# EAGLE schematic mainboard (EAGLE 9.6.1)
Assembly variants: Main
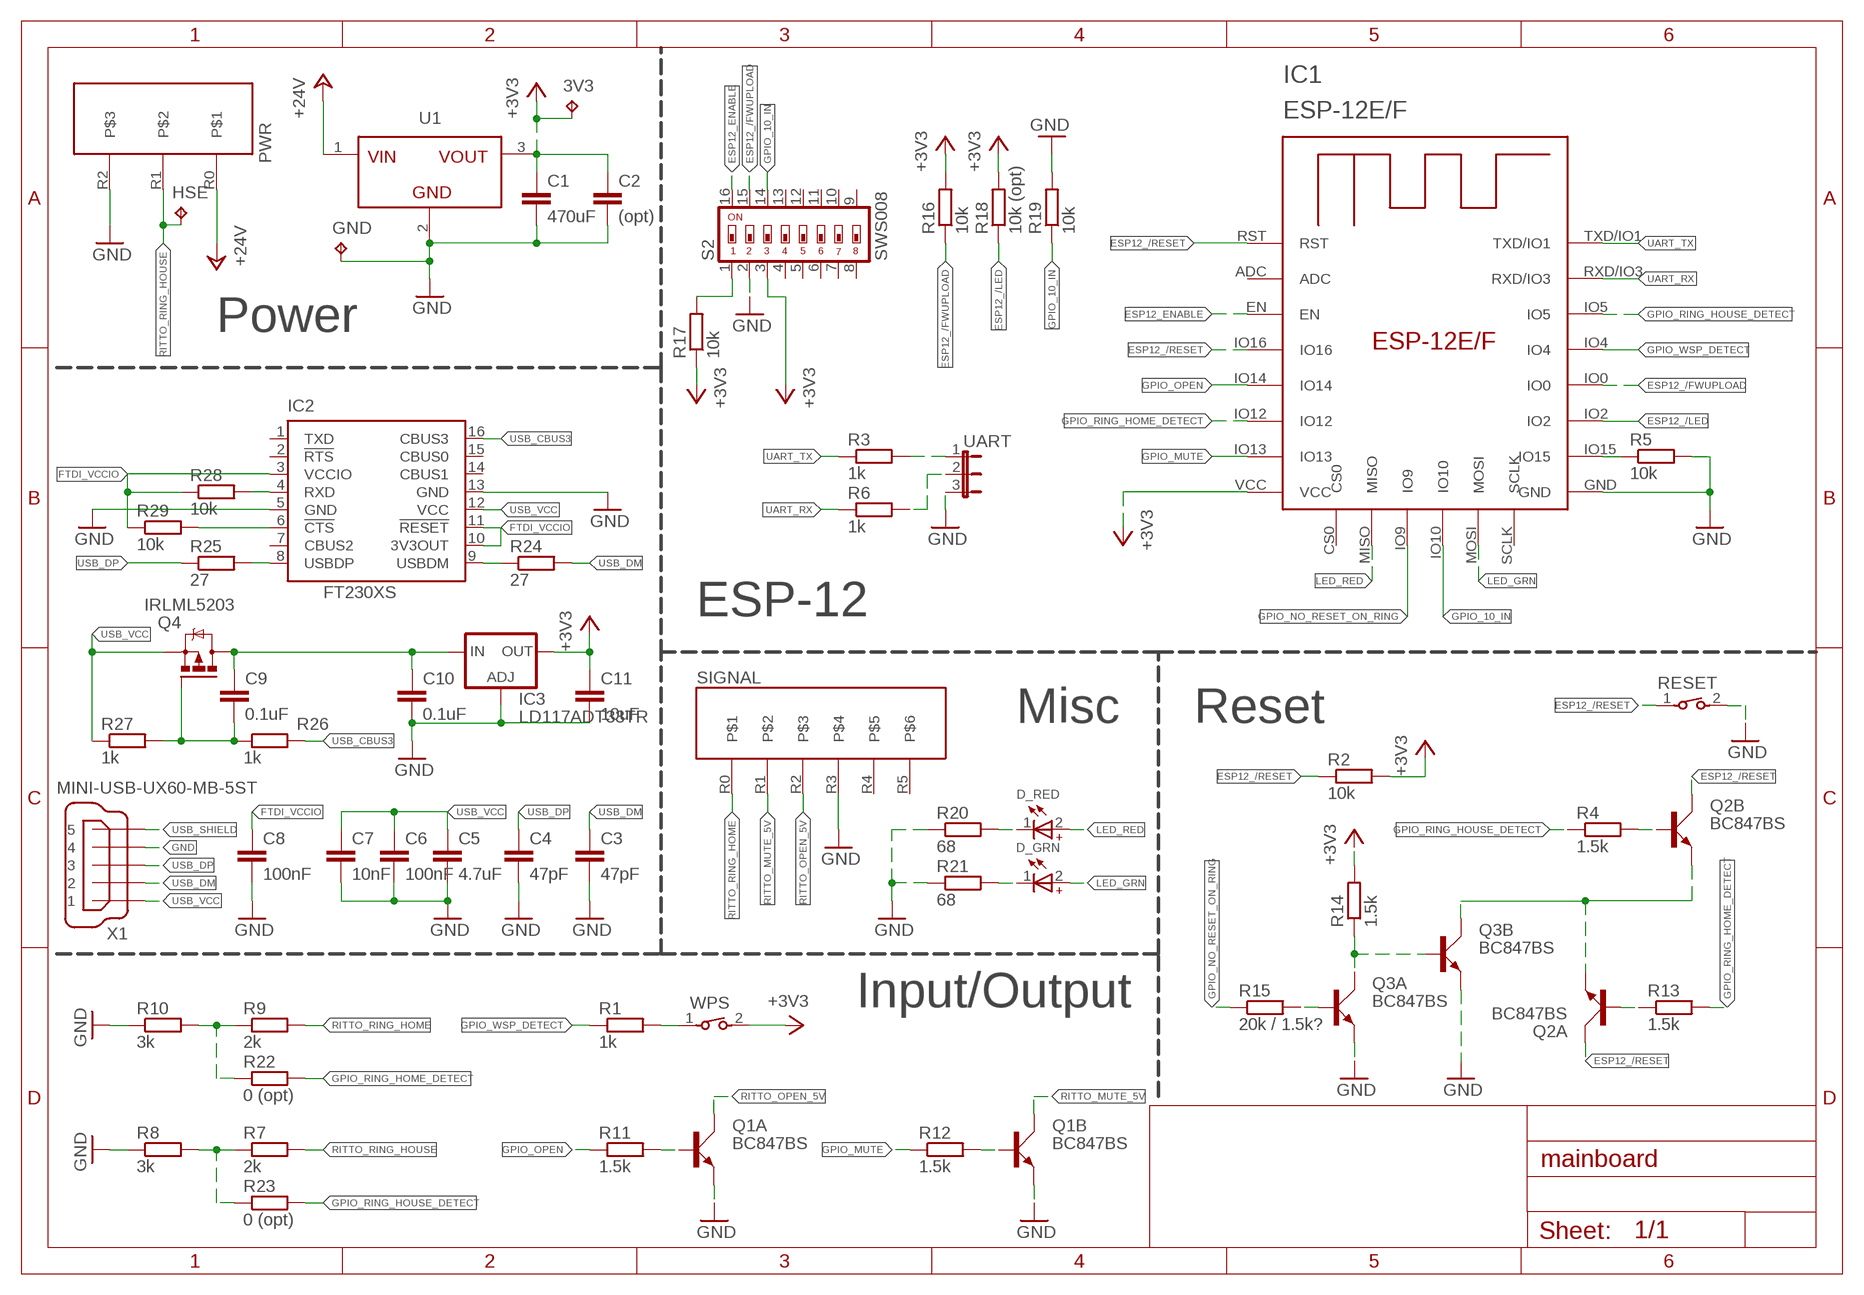
[diagram p0: schematic, sheet 1]

## Parts
3V3  TPTP10SQ  [TP10SQ]
C1  470uF  C-EUC1206  [C1206]
C2  (opt)  C-EUC1206  [C1206]
C3  47pF  C-EUC1206  [C1206]
C4  47pF  C-EUC1206  [C1206]
C5  4.7uF  C-EUC1206  [C1206]
C6  100nF  C-EUC1206  [C1206]
C7  10nF  C-EUC1206  [C1206]
C8  100nF  C-EUC1206  [C1206]
C9  0.1uF  C-EUC1206  [C1206]
C10  0.1uF  C-EUC1206  [C1206]
C11  10uF  C-EUC1206  [C1206]
D_GRN  WL-SMRW_1206_CYL_156120VS75300_NOR  [WL-SMRW_1206_CYL]
D_RED  WL-SMRW_1206_CYL_156120RS75300_NOR  [WL-SMRW_1206_CYL]
GND  TPTP10SQ  [TP10SQ]
HSE  TPTP10SQ  [TP10SQ]
IC1  ESP-12E/F  [ESP-12E]
IC2  FT230XS  [SSOP16]
IC3  LD117ADT33TR  [DPACK]
PWR  RAST_3  [RAST_3]
Q1  BC847BS  [SOT363_PHILIPS]
Q2  BC847BS  [SOT363_PHILIPS]
Q3  BC847BS  [SOT363_PHILIPS]
Q4  IRLML5203  [MICRO3]
R1  1k  R-EU_R1206  [R1206]
R2  10k  R-EU_R1206  [R1206]
R3  1k  R-EU_R1206  [R1206]
R4  1.5k  R-EU_R1206  [R1206]
R5  10k  R-EU_R1206  [R1206]
R6  1k  R-EU_R1206  [R1206]
R7  2k  R-EU_R1206  [R1206]
R8  3k  R-EU_R1206  [R1206]
R9  2k  R-EU_R1206  [R1206]
R10  3k  R-EU_R1206  [R1206]
R11  1.5k  R-EU_R1206  [R1206]
R12  1.5k  R-EU_R1206  [R1206]
R13  1.5k  R-EU_R1206  [R1206]
R14  1.5k  R-EU_R1206  [R1206]
R15  20k / 1.5k?  R-EU_R1206  [R1206]
R16  10k  R-EU_R1206  [R1206]
R17  10k  R-EU_R1206  [R1206]
R18  10k (opt)  R-EU_R1206  [R1206]
R19  10k  R-EU_R1206  [R1206]
R20  68  R-EU_R1206  [R1206]
R21  68  R-EU_R1206  [R1206]
R22  0 (opt)  R-EU_R1206  [R1206]
R23  0 (opt)  R-EU_R1206  [R1206]
R24  27  R-EU_R1206  [R1206]
R25  27  R-EU_R1206  [R1206]
R26  1k  R-EU_R1206  [R1206]
R27  1k  R-EU_R1206  [R1206]
R28  10k  R-EU_R1206  [R1206]
R29  10k  R-EU_R1206  [R1206]
RESET  434123025816  [434123025816]
S2  SWS008  [SMS-008]
SIGNAL  RAST_6  [RAST_6]
U1  MAGI³C-FDSM_SIP-3_173950378_17395XX78  [MAGI³C-FDSM_17395XX78]
UART  JP2E  [JP2]
WPS  434123025816  [434123025816]
X1  MINI-USB-UX60-MB-5ST  [UX60-MB-5ST]

## Nets
+3V3: 3V3.TP C1.1 C2.1 C11.1 IC1.VCC IC3.4(OUT) R2.2 R14.2 R16.2 R17.1 R18.2 S2.3 U1.3(VOUT) WPS.2
+24V: PWR.R0 U1.1(VIN)
ESP12_/FWUPLOAD: IC1.IO0 R16.1 S2.15
ESP12_/LED: IC1.IO2 R18.1
ESP12_/RESET: IC1.IO16 IC1.RST Q2.3(B:C) Q2.6(A:C) R2.1 RESET.1
ESP12_ENABLE: IC1.EN S2.16
FTDI_VCCIO: C8.1 IC2.3(VCCIO) IC2.10(3V3OUT) IC2.11(!RESET) R28.1 R29.1
GND: C1.2 C2.2 C3.2 C4.2 C5.2 C6.2 C7.2 C8.2 C10.2 C11.2 GND.TP IC1.GND IC2.5(GND) IC2.13(GND) IC3.1(ADJ) PWR.R2 Q1.1(A:E) Q1.4(B:E) Q3.1(A:E) Q3.4(B:E) R5.2 R8.1 R10.1 R19.2 R20.1 R21.1 RESET.2 S2.2 SIGNAL.R3 U1.2(GND) UART.3 X1.4
GPIO_10_IN: IC1.IO10 R19.1 S2.14
GPIO_MUTE: IC1.IO13 R12.1
GPIO_NO_RESET_ON_RING: IC1.IO9 R15.1
GPIO_OPEN: IC1.IO14 R11.1
GPIO_RING_HOME_DETECT: IC1.IO12 R13.2 R22.2
GPIO_RING_HOUSE_DETECT: IC1.IO5 R4.1 R23.2
GPIO_WSP_DETECT: IC1.IO4 R1.1
LED_GRN: D_GRN.2(+) IC1.MOSI
LED_RED: D_RED.2(+) IC1.MISO
N$1: R3.2 UART.1
N$2: R6.2 UART.2
N$3: IC1.IO15 R5.1
N$4: R1.2 WPS.1
N$5: R7.1 R8.2 R23.1
N$6: R9.1 R10.2 R22.1
N$7: R17.2 S2.1
N$8: Q2.5(B:B) R4.2
N$9: Q2.2(A:B) R13.1
N$10: Q1.2(A:B) R11.2
N$11: Q1.5(B:B) R12.2
N$12: D_RED.1(-) R20.2
N$13: D_GRN.1(-) R21.2
N$14: Q3.5(B:B) Q3.6(A:C) R14.1
N$15: Q3.2(A:B) R15.2
N$16: Q2.1(A:E) Q2.4(B:E) Q3.3(B:C)
N$17: IC2.9(USBDM) R24.1
N$18: C9.2 Q4.1(G) R26.1 R27.2
N$19: IC2.8(USBDP) R25.2
N$20: C9.1 C10.1 IC3.3(IN) Q4.3(D)
N$21: IC2.4(RXD) R28.2
N$22: IC2.6(!CTS) R29.2
RITTO_MUTE_5V: Q1.3(B:C) SIGNAL.R1
RITTO_OPEN_5V: Q1.6(A:C) SIGNAL.R2
RITTO_RING_HOME: R9.2 SIGNAL.R0
RITTO_RING_HOUSE: HSE.TP PWR.R1 R7.2
UART_RX: IC1.RXD/IO3 R6.1
UART_TX: IC1.TXD/IO1 R3.1
USB_CBUS3: IC2.16(CBUS3) R26.2
USB_DM: C3.1 R24.2 X1.2
USB_DP: C4.1 R25.1 X1.3
USB_SHIELD: X1.5
USB_VCC: C5.1 C6.1 C7.1 IC2.12(VCC) Q4.2(S) R27.1 X1.1
Unconnected: IC1.ADC IC1.CS0 IC1.SCLK IC2.1(TXD) IC2.2(!RTS) IC2.7(CBUS2) IC2.14(CBUS1) IC2.15(CBUS0) S2.4 S2.5 S2.6 S2.7 S2.8 S2.9 S2.10 S2.11 S2.12 S2.13 SIGNAL.R4 SIGNAL.R5

## Notes on the sheet
- Power
- ESP-12
- Misc | Reset
- Input/Output

## Library data of the parts
3V3 GND HSE = testpad:TP: Test pad
C1-C11 = rcl:C-EU: CAPACITOR, European symbol; SPICEPREFIX: C
D_GRN = 156120RS75300_Eagle_WL-SMRW_rev20b:WL-SMRW_1206_CYL: WL-SMRW SMD Mono-color Reverse mount Waterclear Characteristics Small size & thin body for space saving Ideal for narrow space applications Wide viewing angle Low power consumption Industry standard footprint Small LED package for exceptional brightness To emit light through a small cut-out hole in PCB Compatible with automatic placement machine Applications Front panels indicators LCD backlighting Keypad backlighting Push button backlighting Symbol and switch backlighting General LED lighting <https://www.we-online.com/catalog/media/o35733v209%20Family_WL-SMRW_neu.jpg> Details see: http://katalog.we-online.de/en/led/WL-SMRW?m Updated By Yingchun,Shan,2020-03-19 2020 (C) Wurth Elektronik; ABSTRAHLWINKEL: 140°; CHIP-TECHNOLOGY: AlInGaP; DATASHEET-URL: https://www.we-online.com/catalog/datasheet/156120VS75300.pdf; EMITTING-COLOR: Bright Green; I-V-TYP: 30mcd; LAMDA-DOM-TYP: 573nm; LAMDA-PEAK-TYP: 575nm; PART-NUMBER: 156120VS75300; V-F-TYP: 2V
D_RED = 156120RS75300_Eagle_WL-SMRW_rev20b:WL-SMRW_1206_CYL: WL-SMRW SMD Mono-color Reverse mount Waterclear Characteristics Small size & thin body for space saving Ideal for narrow space applications Wide viewing angle Low power consumption Industry standard footprint Small LED package for exceptional brightness To emit light through a small cut-out hole in PCB Compatible with automatic placement machine Applications Front panels indicators LCD backlighting Keypad backlighting Push button backlighting Symbol and switch backlighting General LED lighting <https://www.we-online.com/catalog/media/o35733v209%20Family_WL-SMRW_neu.jpg> Details see: http://katalog.we-online.de/en/led/WL-SMRW?m Updated By Yingchun,Shan,2020-03-19 2020 (C) Wurth Elektronik; ABSTRAHLWINKEL: 140°; CHIP-TECHNOLOGY: AlInGaP; DATASHEET-URL: https://www.we-online.com/catalog/datasheet/156120RS75300.pdf; EMITTING-COLOR: Red; I-V-TYP: 60mcd; LAMDA-DOM-TYP: 624nm; LAMDA-PEAK-TYP: 632nm; PART-NUMBER: 156120RS75300; V-F-TYP: 2V
IC1 = esp-12e-f:ESP-12E/F
IC2 = ftdichip:FT230X: USB to BASIC UART IC Auto generated by make-symbol-device-package-bsdl.ulp Rev. 43 Source: Data sheet <http://www.ftdichip.com/Support/Documents/DataSheets/ICs/DS_FT230X.pdf>
IC3 = v-reg:LD117A?*: Low drop fixed and adjustable positive voltage regulators 1 A Source: http://www.st.com/stonline/products/literature/ds/7194/ld1117axx.pdf
PWR = own_rast:RAST_3: RAST connector with 3 pins
Q1-Q3 = transistor-small-signal:BC847BS: NPN general purpose double transistor Source: http://www.farnell.com/datasheets/2466.pdf
Q4 = transistor-power:IRLML5203: HEXFET P-Channel Power MOSFET
R1-R29 = rcl:R-EU_: RESISTOR, European symbol; SPICEPREFIX: R
RESET WPS = 434123025816_Eagle_WS-TASV_rev20a:434123025816: WS-TASV J-Bend SMT Tact Switch 6.0x3.8 mm Material Properties Cover Material : Stainless Steel Properties Actuator Material:LCP Actuator Flammability :UL94 V-0 Rating Actuator Color:Black;White Frame Material: LCP Frame Flammability Rating :UL94 V-0 Frame Color: Black Contact Material :Stainless Steel Contact Plating: Silver Terminal Material: Copper Alloy Terminal Plating: Silver VR 12 V (DC) Contact Resistance Initial:100 mΩ Contact Resistance After Life Test: 1 Ω RISO:100 MΩ Withstanding Voltage:250 V (AC) Washable:No Qty.:3000 Mechanical Properties Stroke :0.25 mm General Information Operating Temperature:-40 up to +85 °C Washable:No Packaging Properties Packaging:Tape and Reel <https://www.we-online.com/catalog/media/o41273v209%20Family_WS-TASV_J-Bend_SMD_6.0x3.8_J-Bend_Tact_Switch_4341x30258x6.jpg> Details see: https://www.we-online.com/catalog/en/TASV_6_0X3_8_SMD_J-BEND/ Updated by yingchun,Shan;2020-02-20 2020(C) Würth Elektronik; DATASHEET-URL: https://www.we-online.com/catalog/datasheet/434123025816.pdf; H: 2.5mm; OPERATION-FORCE: 160g; PART-NUMBER: 434123025816; QTY: 3000
S2 = smd-special:SWS008: SMD Dip Switch 8 pol.
SIGNAL = own_rast:RAST_6: RAST connector with 6 pins
U1 = Wurth_Step Down Converter_MagI³C-FDSM:MAGI³C-FDSM_SIP-3: MagI³C-FDSM Fixed Step Down Regulator Module Characteristics Simplest design (no power supply knowledge required) Leaded through-hole package for easy manufacturing and prototyping Stand alone solution (CIN and COUT integrated, no external components) L78x series linear regulator replacement (no heatsink required) Low conducted and radiated EMI (compliant to EN55022 class B) Applications Point-of-Load from 24V, 18V, 15V, 12V, 9V rail Replacement for linear regulators Interface and microcontroller supply Industrial, Test & Measurement, Medical applications System power supplies <https://katalog.we-online.com/media/images/v2/o55808v209%20FDSM_MagI3C_173010378_4C.jpg> Details see: https://www.we-online.de/katalog/en/MAGIC_FDSM_FIXED_OUTPUT_VOLTAGE/ Updated by Ella Wu 2020-03-17 2020 (C) Würth Elektronik; DATASHEET-URL: https://www.we-online.de/katalog/datasheet/173950378.pdf; I-OUTPUT: 0.5A; MOUNT: THT; PART-NUMBER: 173950378; V-INPUT: 6-28V; V-OUTPUT: 3.3V
UART = jumper:JP2E: JUMPER
X1 = con-hirose:MINI-USB-: MINI USB Connector Source: http://www.hirose.co.jp/cataloge_hp/e24000019.pdf; OC_FARNELL: unknown; OC_NEWARK: unknown